# Altium project PCB_Project.PrjPcb
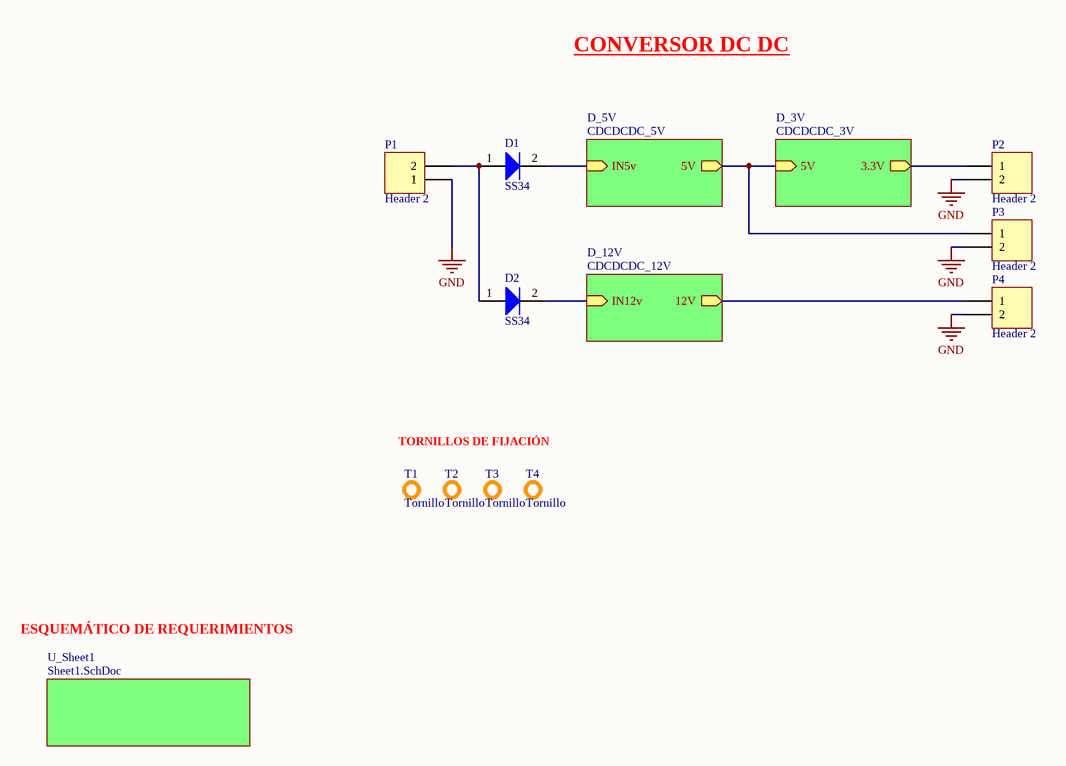
[diagram p0: main_Schematic.SchDoc]
5 sheets, 55 parts. Net scope: hierarchical (ports join the sheet entries above them; power ports are global).
Board file: PCB_doc1.PcbDoc
Sheets:
  main_Schematic.SchDoc
    D_5V = CDCDCDC_5V.SchDoc
    D_3V = CDCDCDC_3V.SchDoc
    D_12V = CDCDCDC_12V.SchDoc
    U_Sheet1 = Sheet1.SchDoc

## Sheet main_Schematic.SchDoc
size A4

### Parts
D1  SS34  [SMC]
D2  SS34  [SMC]
P1  Header 2  [HDR1X2]
P2  Header 2  [HDR1X2]
P3  Header 2  [HDR1X2]
P4  Header 2  [HDR1X2]
T1  Tornillo  [Tornilo - duplicate]
T2  Tornillo  [Tornilo - duplicate]
T3  Tornillo  [Tornilo - duplicate]
T4  Tornillo  [Tornilo - duplicate]

### Sub-sheets
D_3V = CDCDCDC_3V: 5V (in), 3.3V (out)
D_5V = CDCDCDC_5V: IN5v (in), 5V (out)
D_12V = CDCDCDC_12V: IN12v (in), 12V (out)
U_Sheet1 = Sheet1.SchDoc: no entries

### Nets
GND: P1.1 P2.2 P3.2 P4.2
NetD1_1: D1.1(A) D2.1(A) P1.2
NetD1_2: D1.2(K) ; sheet D_5V/IN5v
NetD2_2: D2.2(K) ; sheet D_12V/IN12v
NetP2_1: P2.1 ; sheet D_3V/3.3V
NetP3_1: P3.1 ; sheet D_5V/5V, sheet D_3V/5V
NetP4_1: P4.1 ; sheet D_12V/12V

### Notes on the sheet
- CONVERSOR DC DC
- TORNILLOS DE FIJACIÓN
- ESQUEMÁTICO DE REQUERIMIENTOS

### Library data of the parts
D1 D2 = Diode: Default Diode; Published: 8-Jun-2000; LatestRevisionDate: 17-Jul-2002; LatestRevisionNote: Re-released for DXP Platform.; PackageVersion: Sep-1996; PackageReference: SMC; Publisher: Altium Limited; PackageDescription: DO-214-AB/SMC; 2 C-Bend Leads; Body 7.9 x 5.9 mm, inc. leads (LxW); Code_JEDEC: DO-214-AB
P1-P4 = Header 2: Header, 2-Pin; LatestRevisionDate: 17-Jul-2002; LatestRevisionNote: Re-released for DXP Platform.; Publisher: Altium Limited

## Sheet CDCDCDC_5V.SchDoc
size A4
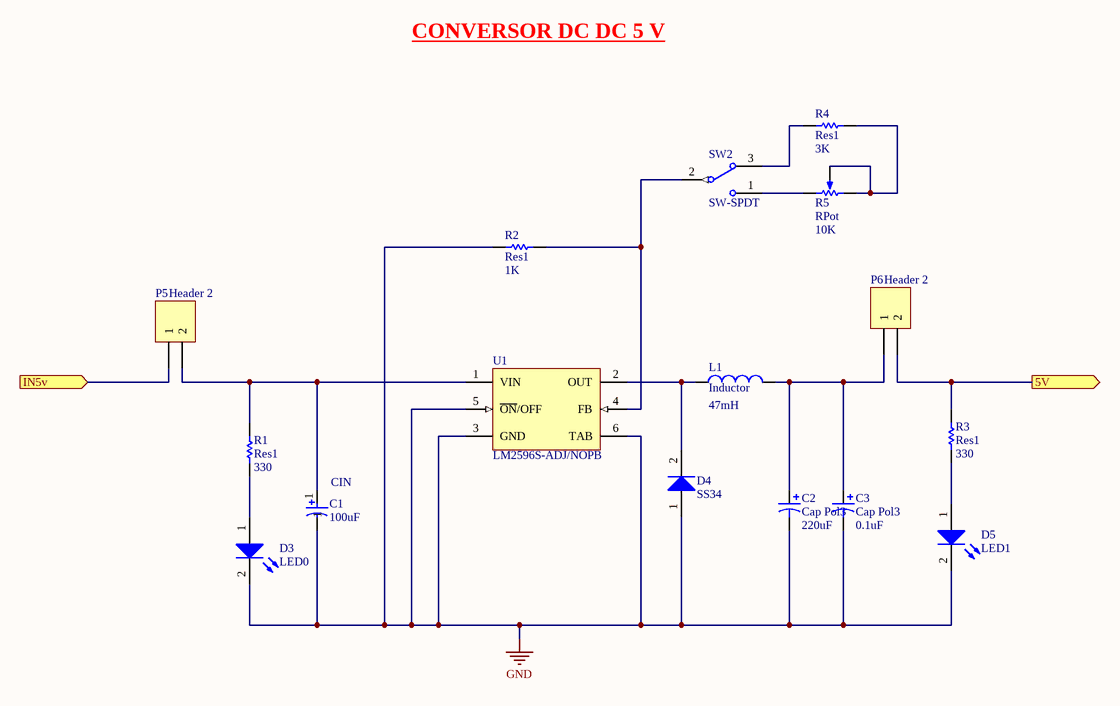
[diagram p1: CDCDCDC_5V.SchDoc]

### Parts
C1  100uF  [NIC-UWT1H101MNL1GS_N]
C2  Cap Pol3  value 220uF  [1812]
C3  Cap Pol3  value 0.1uF  [1812]
D3  LED0  [LED-0]
D4  SS34  [SMC]
D5  LED1  [LED-0]
L1  Inductor  value 47mH  [0402-A]
P5  Header 2  [HDR1X2]
P6  Header 2  [HDR1X2]
R1  Res1  value 330  [AXIAL-0.3]
R2  Res1  value 1K  [AXIAL-0.3]
R3  Res1  value 330  [AXIAL-0.3]
R4  Res1  value 3K  [AXIAL-0.3]
R5  RPot  value 10K  [VR5]
SW2  SW-SPDT  [TL36WW15050]
U1  LM2596S-ADJ/NOPB  [KTT0005B_N]

### Ports
5V (out), IN5v (in)

### Nets
GND: C1.2 C2.2 C3.2 D3.2(K) D4.1(A) D5.2(K) R2.2 U1.3(GND) U1.5(~{ON}/OFF) U1.6(TAB)
NetC1_1: C1.1 P5.2 R1.2 U1.1(VIN)
NetC2_1: C2.1 C3.1 L1.2 P6.1
NetD1_2: P5.1 ; port IN5v
NetD3_1: D3.1(A) R1.1
NetD4_2: D4.2(K) L1.1 U1.2(OUT)
NetD5_1: D5.1(A) R3.1
NetP3_1: P6.2 R3.2 ; port 5V
NetR2_1: R2.1 SW2.2 U1.4(FB)
NetR4_1: R4.1 R5.1(TOP) R5.3(TAP)
NetR4_2: R4.2 SW2.3
NetR5_2: R5.2(BOT) SW2.1

### Notes on the sheet
- CONVERSOR DC DC 5 V
- (near C1) CIN

### Library data of the parts
C1 = CMP-2000-07373-1: Aluminum Electrolytic Capacitor, 100 uF, +/- 20%, 50 V, -55 to 105 degC, 2-Pin SMD, RoHS, Tape and Reel; Manufacturer: Nichicon; Capacitance: 100µF; Type: Can; Rated Voltage: 50V; Datasheet Version: 08/2015; Operating Temp-Max: 105°C; Mounting Technology: SurfaceMount; Datasheet URL: http://products.nichicon.co.jp/en/pdf/XJA043/e-uwt.pdf; Package Description: Aluminum Electrolytic Capacitor, Body 8.3 x 8.3 mm, Height 10.8 mm; Package Reference: UWT1H101MNL1GS; Case Size/Dimension: Ø8x10mm; Manufacturer URL: http://www.nichicon.co.jp/english/
C2 C3 = Cap Pol3: Polarized Capacitor (Surface Mount); Published: 8-Jun-2000; LatestRevisionDate: 29-May-2009; LatestRevisionNote: IPC-7351 Footprint Added.; PackageReference: C0805; Publisher: Altium Limited; PackageDescription: Chip Capacitor
D3 D5 = LED0: Typical INFRARED GaAs LED; Published: 8-Jun-2000; LatestRevisionDate: 08-Jul-2005; LatestRevisionNote: Mech Layer 1 removed.; PackageReference: LED-0; Publisher: Altium Limited; PackageDescription: LED; 2 Leads
D4 = Diode: Default Diode; Published: 8-Jun-2000; LatestRevisionDate: 17-Jul-2002; LatestRevisionNote: Re-released for DXP Platform.; PackageVersion: Sep-1996; PackageReference: SMC; Publisher: Altium Limited; PackageDescription: DO-214-AB/SMC; 2 C-Bend Leads; Body 7.9 x 5.9 mm, inc. leads (LxW); Code_JEDEC: DO-214-AB
L1 = Inductor: Code_IEC: 1005; Published: 8-Jun-2000; LatestRevisionDate: 29-May-2009; LatestRevisionNote: IPC-7351 Footprint Added.; PackageReference: 0402-A; Publisher: Altium Limited; PackageDescription: Chip Inductor; Code_JEITA: 0402
P5 P6 = Header 2: Header, 2-Pin; LatestRevisionDate: 17-Jul-2002; LatestRevisionNote: Re-released for DXP Platform.; Publisher: Altium Limited
R1-R4 = Res1: Resistor; Published: 8-Jun-2000; LatestRevisionDate: 17-Jul-2002; LatestRevisionNote: Re-released for DXP Platform.; PackageReference: AXIAL-0.3; Publisher: Altium Limited; PackageDescription: Axial Device, Thru-Hole; 2 Leads; 0.3 in Pin Spacing
R5 = RPot: Potentiometer; Sim Note: Enter the Resistance value and the set point into parameter fields.; Set Position: 0.5; Published: 8-Jun-2000; LatestRevisionDate: 17-Jul-2002; LatestRevisionNote: Re-released for DXP Platform.; PackageReference: VR5; Publisher: Altium Limited; PackageDescription: Variable Resistor, Thru-Hole; 3 Leads
SW2 = SW-SPDT: SPDT Subminiature Toggle Switch, Right Angle Mounting, Vertical Actuation; Published: 24-Mar-1999; LatestRevisionDate: 17-Dec-2003; LatestRevisionNote: Schematic revised, PCB Footprint replaced.; DatasheetVersion: 05-Dec-2000; PackageReference: TL36WW15050; Publisher: Altium Limited; PackageDescription: Switch; 4 Leads; ComponentLink1Description: Manufacturer Link; ComponentLink1URL: http://www.apem.com
U1 = CMP-0069-00271-3: SIMPLE SWITCHER® Power Converter 150 KHz 3A Step-Down Voltage Regulator, 5-pin TO-263, Pb-Free; Manufacturer: Texas Instruments; PowerWise: N; PackageTopMarking: NSUZXYTTE#*LM2596S*-ADJ P+; ComponentLink1Description: Datasheet URL; PackageDescription: TO-263, Molded, .400 x .390 x .180in, 5 Lead, .067in Pitch, Surface Mount; ComponentLink1URL: http://www.ti.com/general/docs/lit/getliterature.tsp?genericPartNumber=LM2596&fileType=pdf; Code_JEDEC: MO-169-AB; PinCount: 5; CompType: Switcher; PackageReference: KTT0005B; RoHS: Y

## Sheet CDCDCDC_3V.SchDoc
size A4
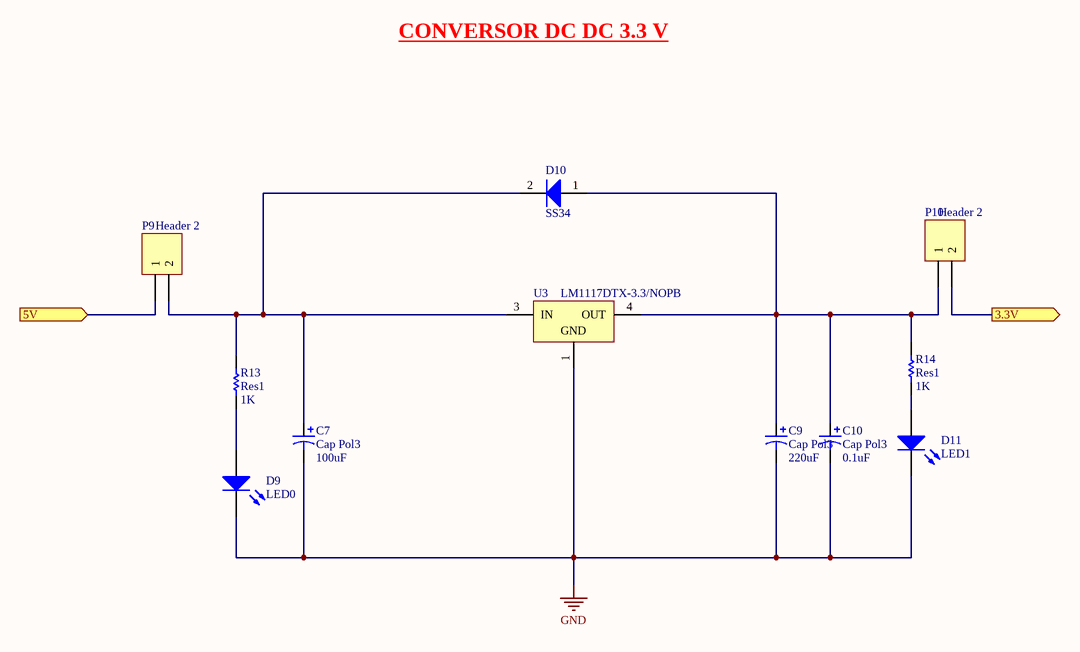
[diagram p2: CDCDCDC_3V.SchDoc]

### Parts
C7  Cap Pol3  value 100uF  [1812]
C9  Cap Pol3  value 220uF  [1812]
C10  Cap Pol3  value 0.1uF  [1812]
D9  LED0  [LED-0]
D10  SS34  [SMC]
D11  LED1  [LED-0]
P9  Header 2  [HDR1X2]
P10  Header 2  [HDR1X2]
R13  Res1  value 1K  [AXIAL-0.3]
R14  Res1  value 1K  [AXIAL-0.3]
U3  LM1117DTX-3.3/NOPB  [NDP0003B_L]

### Ports
3.3V (out), 5V (in)

### Nets
GND: C7.2 C9.2 C10.2 D9.2(K) D11.2(K) U3.1(GND)
NetC7_1: C7.1 D10.2(K) P9.2 R13.2 U3.3(IN)
NetC9_1: C9.1 C10.1 D10.1(A) P10.1 R14.2 U3.4(OUT)
NetD9_1: D9.1(A) R13.1
NetD11_1: D11.1(A) R14.1
NetP2_1: P10.2 ; port 3.3V
NetP3_1: P9.1 ; port 5V

### Notes on the sheet
- CONVERSOR DC DC 3.3 V

### Library data of the parts
C7 C9 C10 = Cap Pol3: Polarized Capacitor (Surface Mount); Published: 8-Jun-2000; LatestRevisionDate: 29-May-2009; LatestRevisionNote: IPC-7351 Footprint Added.; PackageReference: C0805; Publisher: Altium Limited; PackageDescription: Chip Capacitor
D9 D11 = LED0: Typical INFRARED GaAs LED; Published: 8-Jun-2000; LatestRevisionDate: 08-Jul-2005; LatestRevisionNote: Mech Layer 1 removed.; PackageReference: LED-0; Publisher: Altium Limited; PackageDescription: LED; 2 Leads
D10 = Diode: Default Diode; Published: 8-Jun-2000; LatestRevisionDate: 17-Jul-2002; LatestRevisionNote: Re-released for DXP Platform.; PackageVersion: Sep-1996; PackageReference: SMC; Publisher: Altium Limited; PackageDescription: DO-214-AB/SMC; 2 C-Bend Leads; Body 7.9 x 5.9 mm, inc. leads (LxW); Code_JEDEC: DO-214-AB
P9 P10 = Header 2: Header, 2-Pin; LatestRevisionDate: 17-Jul-2002; LatestRevisionNote: Re-released for DXP Platform.; Publisher: Altium Limited
R13 R14 = Res1: Resistor; Published: 8-Jun-2000; LatestRevisionDate: 17-Jul-2002; LatestRevisionNote: Re-released for DXP Platform.; PackageReference: AXIAL-0.3; Publisher: Altium Limited; PackageDescription: Axial Device, Thru-Hole; 2 Leads; 0.3 in Pin Spacing
U3 = CMP-0062-00704-3: 800mA Low-Dropout Linear Regulator, 3-pin TO-252, Pb-Free; Manufacturer: Texas Instruments; CompType: LDO IC; PowerWise: N; PackageTopMarking: NSUZXYTT*LM1117*DT-3.3; ComponentLink1URL: http://www.ti.com/general/docs/lit/getliterature.tsp?genericPartNumber=LM1117-N&fileType=pdf; Code_JEDEC: TO-252-AA; ComponentLink1Description: Datasheet URL; PackageDescription: TO252, Molded, Jedec, 6.8 x 6.10 x 2.30mm Body, 3 Lead, 2.28mm Pitch, Surface Mount; PinCount: 3; RoHS: Y; PackageReference: NDP0003B

## Sheet CDCDCDC_12V.SchDoc
size A4
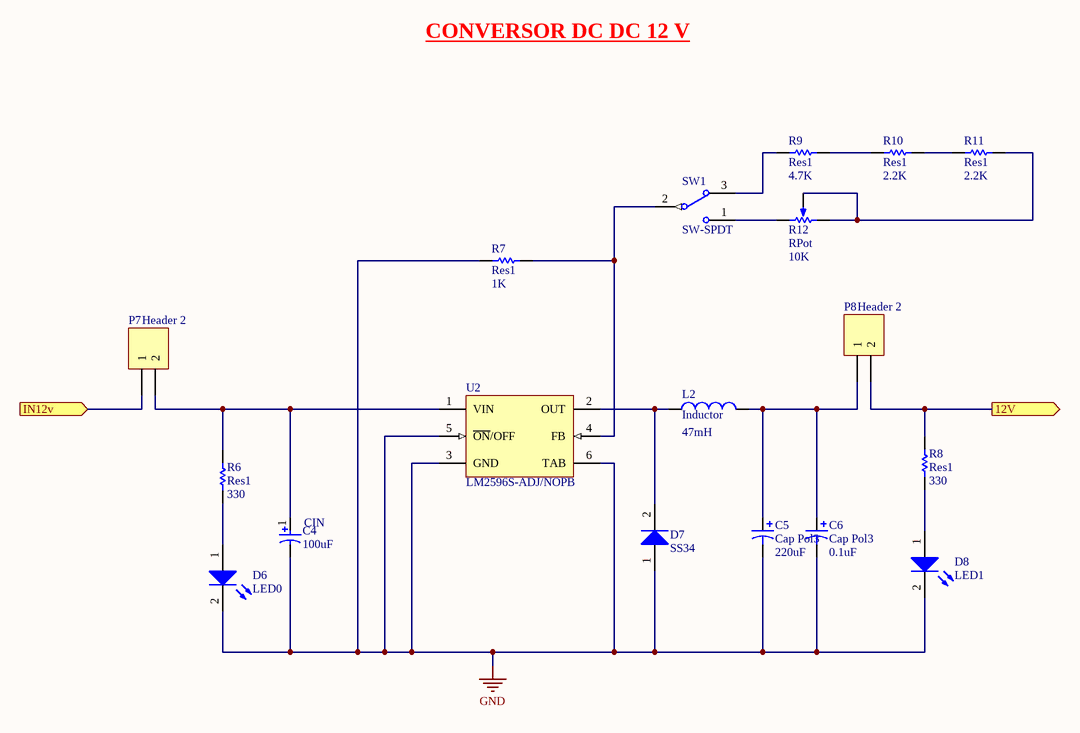
[diagram p3: CDCDCDC_12V.SchDoc]

### Parts
C4  100uF  [NIC-UWT1H101MNL1GS_N]
C5  Cap Pol3  value 220uF  [1812]
C6  Cap Pol3  value 0.1uF  [1812]
D6  LED0  [LED-0]
D7  SS34  [SMC]
D8  LED1  [LED-0]
L2  Inductor  value 47mH  [0402-A]
P7  Header 2  [HDR1X2]
P8  Header 2  [HDR1X2]
R6  Res1  value 330  [AXIAL-0.3]
R7  Res1  value 1K  [AXIAL-0.3]
R8  Res1  value 330  [AXIAL-0.3]
R9  Res1  value 4.7K  [AXIAL-0.3]
R10  Res1  value 2.2K  [AXIAL-0.3]
R11  Res1  value 2.2K  [AXIAL-0.3]
R12  RPot  value 10K  [VR5]
SW1  SW-SPDT  [TL36WW15050]
U2  LM2596S-ADJ/NOPB  [KTT0005B_N]

### Ports
12V (out), IN12v (in)

### Nets
GND: C4.2 C5.2 C6.2 D6.2(K) D7.1(A) D8.2(K) R7.2 U2.3(GND) U2.5(~{ON}/OFF) U2.6(TAB)
NetC4_1: C4.1 P7.2 R6.2 U2.1(VIN)
NetC5_1: C5.1 C6.1 L2.2 P8.1
NetD2_2: P7.1 ; port IN12v
NetD6_1: D6.1(A) R6.1
NetD7_2: D7.2(K) L2.1 U2.2(OUT)
NetD8_1: D8.1(A) R8.1
NetP4_1: P8.2 R8.2 ; port 12V
NetR7_1: R7.1 SW1.2 U2.4(FB)
NetR9_1: R9.1 R10.2
NetR9_2: R9.2 SW1.3
NetR10_1: R10.1 R11.2
NetR11_1: R11.1 R12.1(TOP) R12.3(TAP)
NetR12_2: R12.2(BOT) SW1.1

### Notes on the sheet
- CONVERSOR DC DC 12 V
- (near C4) CIN

### Library data of the parts
C4 = CMP-2000-07373-1: as C1 on sheet CDCDCDC_5V; Datasheet Version: 08/2015; Operating Temp-Max: 105°C; Mounting Technology: SurfaceMount; Datasheet URL: http://products.nichicon.co.jp/en/pdf/XJA043/e-uwt.pdf; Package Description: Aluminum Electrolytic Capacitor, Body 8.3 x 8.3 mm, Height 10.8 mm; Package Reference: UWT1H101MNL1GS; Case Size/Dimension: Ø8x10mm; Manufacturer URL: http://www.nichicon.co.jp/english/
C5 C6 = Cap Pol3: Polarized Capacitor (Surface Mount); Published: 8-Jun-2000; LatestRevisionDate: 29-May-2009; LatestRevisionNote: IPC-7351 Footprint Added.; PackageReference: C0805; Publisher: Altium Limited; PackageDescription: Chip Capacitor
D6 D8 = LED0: Typical INFRARED GaAs LED; Published: 8-Jun-2000; LatestRevisionDate: 08-Jul-2005; LatestRevisionNote: Mech Layer 1 removed.; PackageReference: LED-0; Publisher: Altium Limited; PackageDescription: LED; 2 Leads
D7 = Diode: Default Diode; Published: 8-Jun-2000; LatestRevisionDate: 17-Jul-2002; LatestRevisionNote: Re-released for DXP Platform.; PackageVersion: Sep-1996; PackageReference: SMC; Publisher: Altium Limited; PackageDescription: DO-214-AB/SMC; 2 C-Bend Leads; Body 7.9 x 5.9 mm, inc. leads (LxW); Code_JEDEC: DO-214-AB
L2 = Inductor: Code_IEC: 1005; Published: 8-Jun-2000; LatestRevisionDate: 29-May-2009; LatestRevisionNote: IPC-7351 Footprint Added.; PackageReference: 0402-A; Publisher: Altium Limited; PackageDescription: Chip Inductor; Code_JEITA: 0402
P7 P8 = Header 2: Header, 2-Pin; LatestRevisionDate: 17-Jul-2002; LatestRevisionNote: Re-released for DXP Platform.; Publisher: Altium Limited
R6-R11 = Res1: Resistor; Published: 8-Jun-2000; LatestRevisionDate: 17-Jul-2002; LatestRevisionNote: Re-released for DXP Platform.; PackageReference: AXIAL-0.3; Publisher: Altium Limited; PackageDescription: Axial Device, Thru-Hole; 2 Leads; 0.3 in Pin Spacing
R12 = RPot: as R5 on sheet CDCDCDC_5V; Published: 8-Jun-2000; LatestRevisionDate: 17-Jul-2002; LatestRevisionNote: Re-released for DXP Platform.; PackageReference: VR5; Publisher: Altium Limited; PackageDescription: Variable Resistor, Thru-Hole; 3 Leads
SW1 = SW-SPDT: as SW2 on sheet CDCDCDC_5V; Published: 24-Mar-1999; LatestRevisionDate: 17-Dec-2003; LatestRevisionNote: Schematic revised, PCB Footprint replaced.; DatasheetVersion: 05-Dec-2000; PackageReference: TL36WW15050; Publisher: Altium Limited; PackageDescription: Switch; 4 Leads; ComponentLink1Description: Manufacturer Link; ComponentLink1URL: http://www.apem.com
U2 = CMP-0069-00271-3: as U1 on sheet CDCDCDC_5V; ComponentLink1Description: Datasheet URL; PackageDescription: TO-263, Molded, .400 x .390 x .180in, 5 Lead, .067in Pitch, Surface Mount; ComponentLink1URL: http://www.ti.com/general/docs/lit/getliterature.tsp?genericPartNumber=LM2596&fileType=pdf; Code_JEDEC: MO-169-AB; PinCount: 5; CompType: Switcher; PackageReference: KTT0005B; RoHS: Y

## Sheet Sheet1.SchDoc
size A4
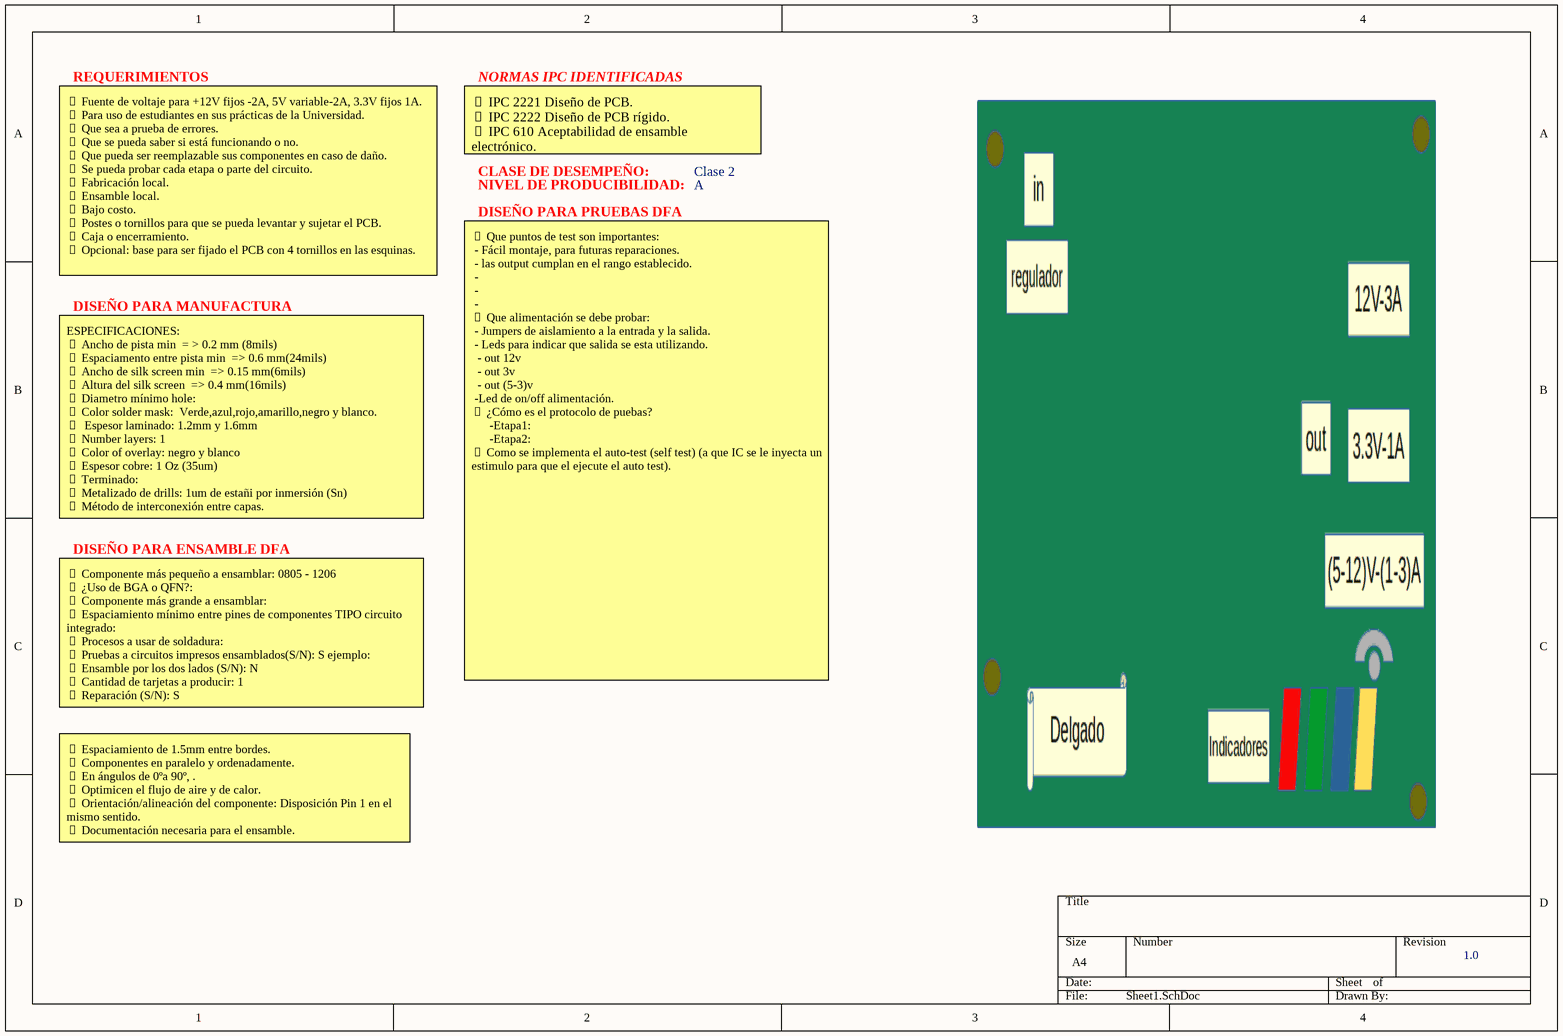
[diagram p4: Sheet1.SchDoc]

### Notes on the sheet
- REQUERIMIENTOS
- NORMAS IPC IDENTIFICADAS
-  IPC 2221 Diseño de PCB.
   IPC 2222 Diseño de PCB rígido.
   IPC 610 Aceptabilidad de ensamble electrónico.
- CLASE DE DESEMPEÑO:
- Clase 2
- NIVEL DE PRODUCIBILIDAD:
- DISEÑO PARA PRUEBAS DFA
- A
-  Fuente de voltaje para +12V fijos -2A, 5V variable-2A, 3.3V fijos 1A.
   Para uso de estudiantes en sus prácticas de la Universidad.
   Que sea a prueba de errores.
   Que se pueda saber si está funcionando o no.
   Que pueda ser reemplazable sus componentes en caso de daño.
   Se pueda probar cada etapa o parte del circuito.
   Fabricación local.
   Ensamble local.
   Bajo costo.
   Postes o tornillos para que se pueda levantar y sujetar el PCB.
   Caja o encerramiento.
   Opcional: base para ser fijado el PCB con 4 tornillos en las esquinas.
- DISEÑO PARA MANUFACTURA
- ESPECIFICACIONES:
   Ancho de pista min  = > 0.2 mm (8mils)
   Espaciamento entre pista min  => 0.6 mm(24mils)
   Ancho de silk screen min  => 0.15 mm(6mils)
   Altura del silk screen  => 0.4 mm(16mils)
   Diametro mínimo hole:
   Color solder mask:  Verde,azul,rojo,amarillo,negro y blanco.
    Espesor laminado: 1.2mm y 1.6mm
   Number layers: 1
   Color of overlay: negro y blanco
   Espesor cobre: 1 Oz (35um)
   Terminado:
   Metalizado de drills: 1um de estañi por inmersión (Sn)
   Método de interconexión entre capas.
- DISEÑO PARA ENSAMBLE DFA
-  Componente más pequeño a ensamblar: 0805 - 1206
   ¿Uso de BGA o QFN?:
   Componente más grande a ensamblar:
   Espaciamiento mínimo entre pines de componentes TIPO circuito integrado:
   Procesos a usar de soldadura:
   Pruebas a circuitos impresos ensamblados(S/N): S ejemplo:
   Ensamble por los dos lados (S/N): N
   Cantidad de tarjetas a producir: 1
   Reparación (S/N): S
-  Que puntos de test son importantes:
  - Fácil montaje, para futuras reparaciones.
  - las output cumplan en el rango establecido.
  -
  -
  -
   Que alimentación se debe probar:
  - Jumpers de aislamiento a la entrada y la salida.
  - Leds para indicar que salida se esta utilizando.
  - out 12v
  - out 3v
  - out (5-3)v
  -Led de on/off alimentación.
   ¿Cómo es el protocolo de puebas?
  -Etapa1:
  -Etapa2:
   Como se implementa el auto-test (self test) (a que IC se le inyecta un estimulo para que el ejecute el auto test).
-  Espaciamiento de 1.5mm entre bordes.
   Componentes en paralelo y ordenadamente.
   En ángulos de 0ºa 90º, .
   Optimicen el flujo de aire y de calor.
   Orientación/alineación del componente: Disposición Pin 1 en el mismo sentido.
   Documentación necesaria para el ensamble.
- 1.0

## Nets that join several sheets
GND: main_Schematic (P1.1 P2.2 P3.2 P4.2), CDCDCDC_5V (10 pins), CDCDCDC_3V (6 pins), CDCDCDC_12V (10 pins)
NetD1_2: main_Schematic (D1.2), CDCDCDC_5V (P5.1)
NetD2_2: main_Schematic (D2.2), CDCDCDC_12V (P7.1)
NetP2_1: main_Schematic (P2.1), CDCDCDC_3V (P10.2)
NetP3_1: main_Schematic (P3.1), CDCDCDC_5V (P6.2 R3.2), CDCDCDC_3V (P9.1)
NetP4_1: main_Schematic (P4.1), CDCDCDC_12V (P8.2 R8.2)